# Altium schematic sheet MB_dac.SchDoc: Материнская плата
size 420 x 297 mm; DrawnBy: В.Титов; DocumentNumber: ХХХХ.468179.001 Э3; SheetNumber: 6; SheetTotal: 7; DocumentType: Схема электрическая принципиальная; Title2: Питание процессора
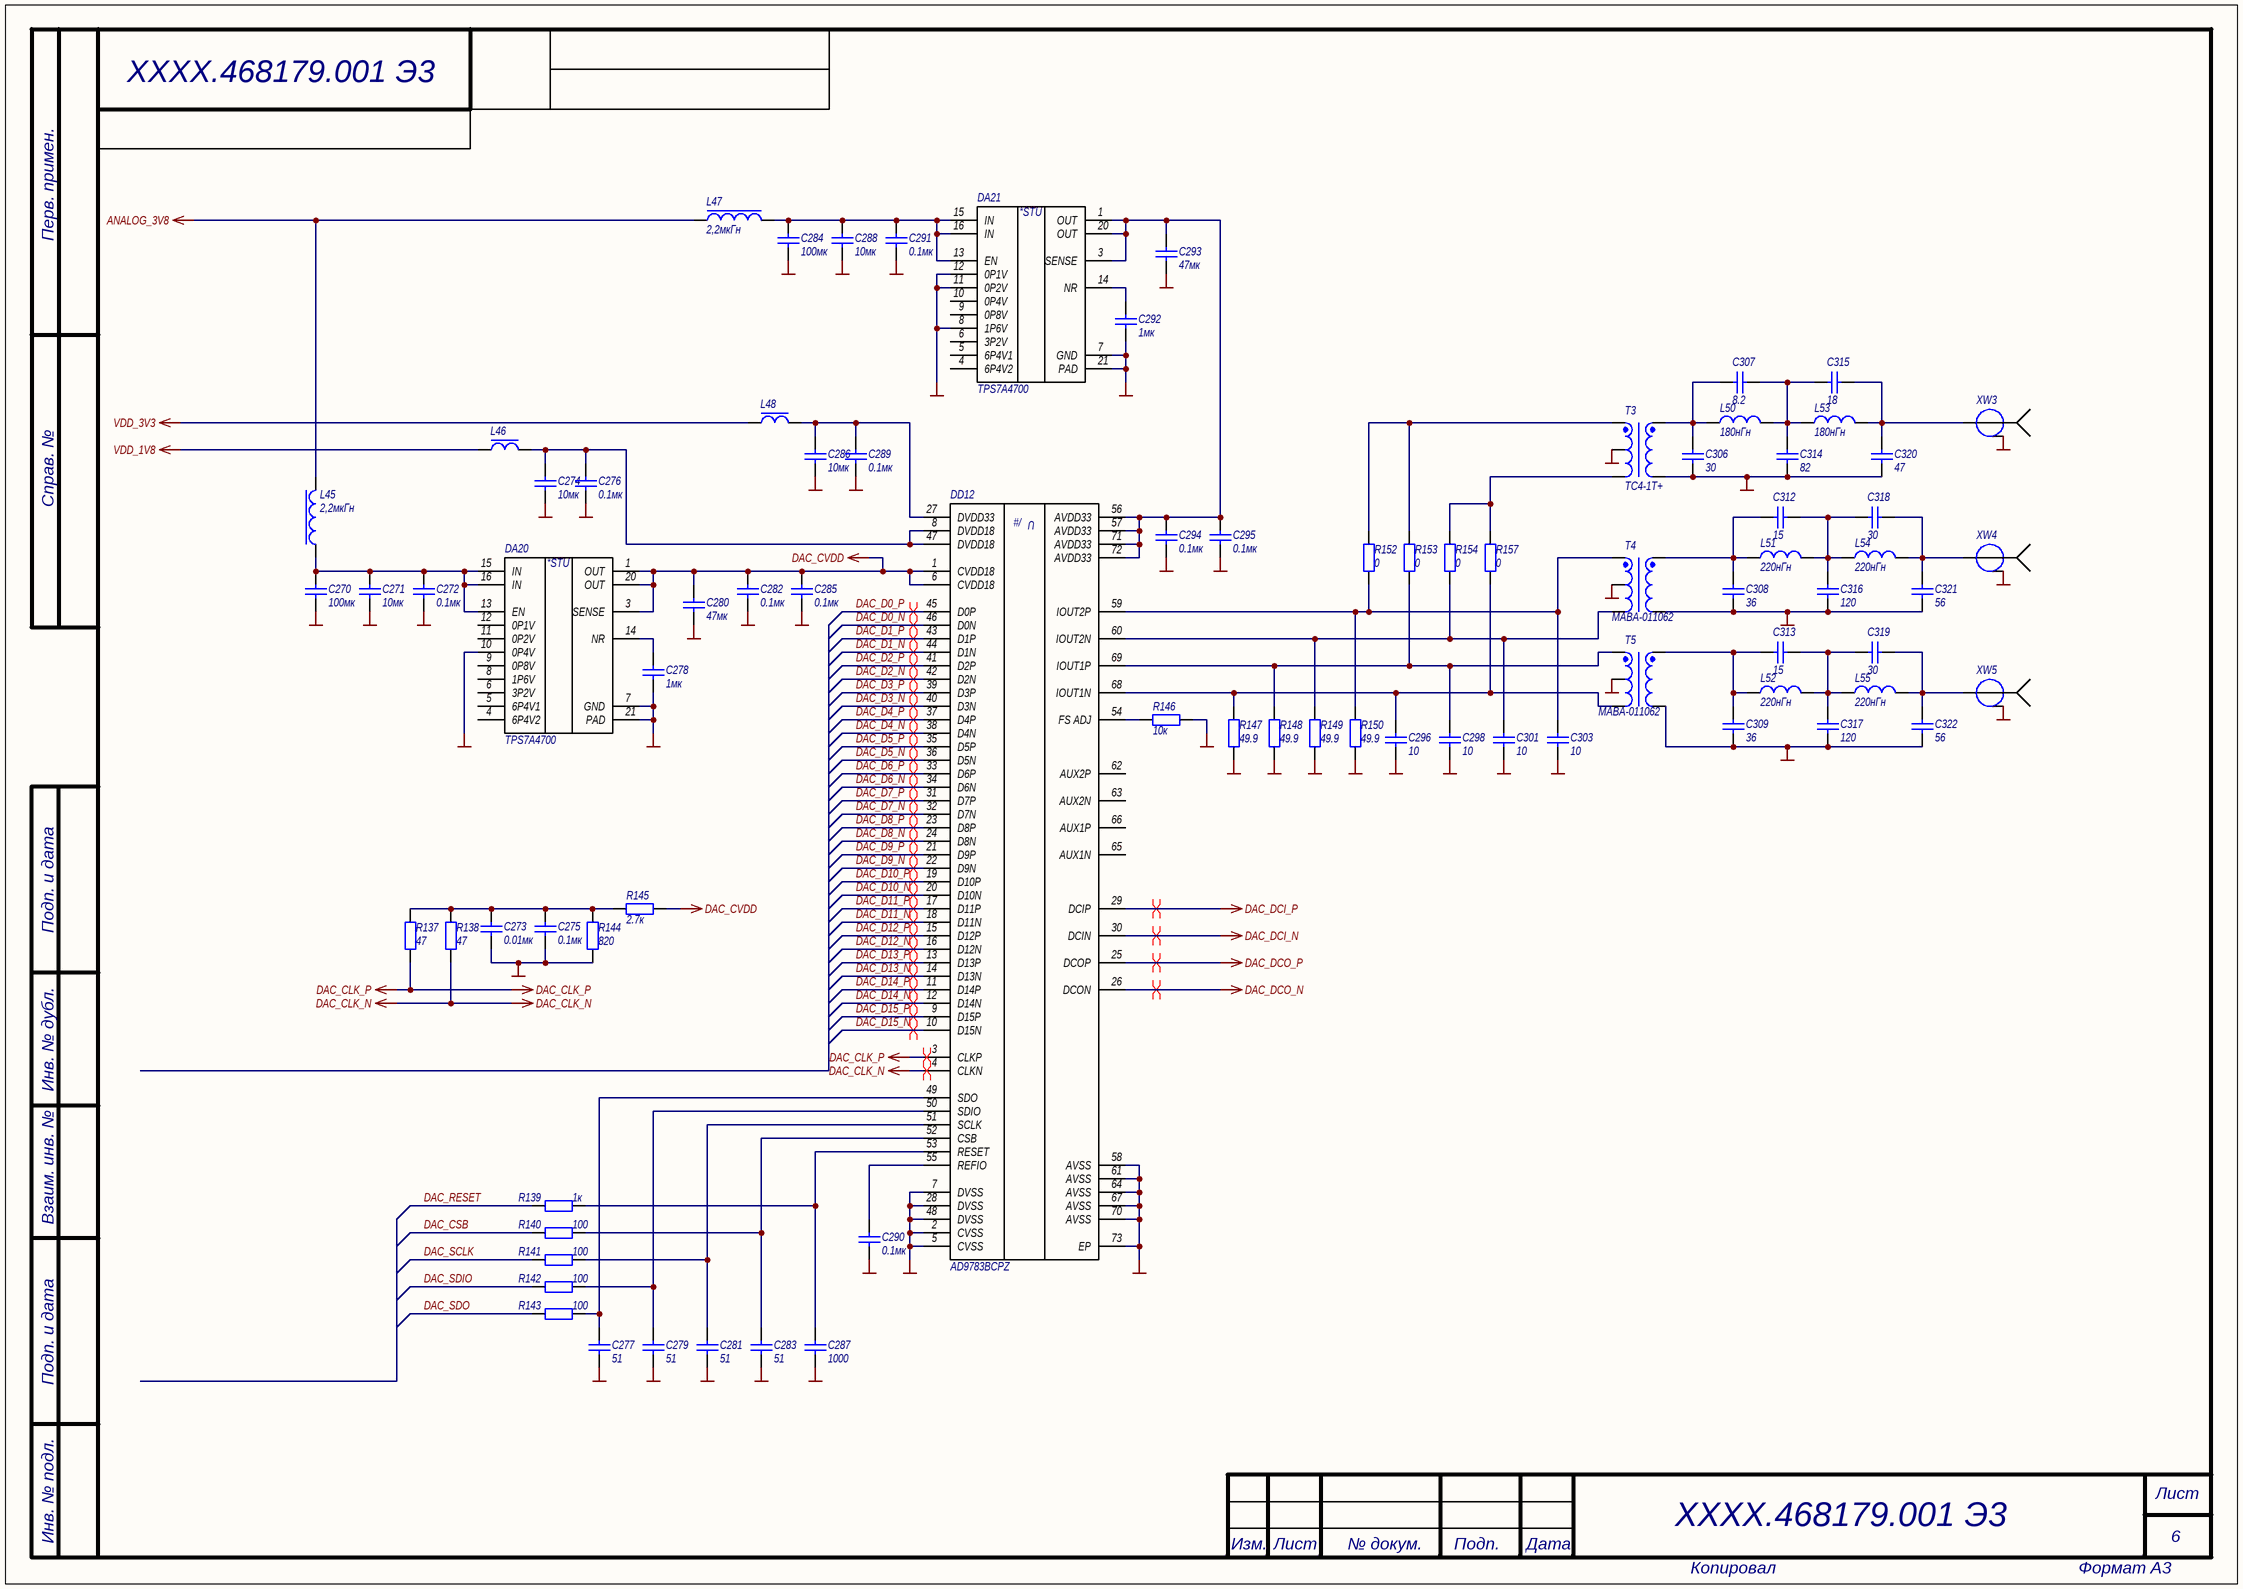
[diagram p0: MB_dac.SchDoc]

## Parts
C270  100мк  [CAPC3216X19L]
C271  10мк  [CAPC1608X08L]
C272  0.1мк  [CAPC1005X06N]
C273  0.01мк  [CAPC1005X06N]
C274  10мк  [CAPC1608X08L]
C275  0.1мк  [CAPC1005X06N]
C276  0.1мк  [CAPC1005X06N]
C277  51  [CAPC1005X06N]
C278  1мк  [CAPC1005X06N]
C279  51  [CAPC1005X06N]
C280  47мк  [CAPC2012X12L]
C281  51  [CAPC1005X06N]
C282  0.1мк  [CAPC1005X06N]
C283  51  [CAPC1005X06N]
C284  100мк  [CAPC3216X19L]
C285  0.1мк  [CAPC1005X06N]
C286  10мк  [CAPC1608X08L]
C287  1000  [CAPC1005X06N]
C288  10мк  [CAPC1608X08L]
C289  0.1мк  [CAPC1005X06N]
C290  0.1мк  [CAPC1005X06N]
C291  0.1мк  [CAPC1005X06N]
C292  1мк  [CAPC1005X06N]
C293  47мк  [CAPC2012X12L]
C294  0.1мк  [CAPC1005X06N]
C295  0.1мк  [CAPC1005X06N]
C296  10  [CAPC1005X06N]
C298  10  [CAPC1005X06N]
C301  10  [CAPC1005X06N]
C303  10  [CAPC1005X06N]
C306  30  [CAPC1005X06N]
C307  8.2  [CAPC1005X06N]
C308  36  [CAPC1005X06N]
C309  36  [CAPC1005X06N]
C312  15  [CAPC1005X06N]
C313  15  [CAPC1005X06N]
C314  82  [CAPC1005X06N]
C315  18  [CAPC1005X06N]
C316  120  [CAPC1005X06N]
C317  120  [CAPC1005X06N]
C318  30  [CAPC1005X06N]
C319  30  [CAPC1005X06N]
C320  47  [CAPC1005X06N]
C321  56  [CAPC1005X06N]
C322  56  [CAPC1005X06N]
DA20  TPS7A4700  [QFN65P500X500X100_HS-21L]
DA21  TPS7A4700  [QFN65P500X500X100_HS-21L]
DD12  AD9783BCPZ  [LFCSP_VQ_72]
L45  2,2мкГн  [CSAB0420]
L46  BLM18PG121SN1D  [INDC1608X08L]  (value not drawn)
L47  2,2мкГн  [CSAB0420]
L48  BLM18PG121SN1D  [INDC1608X08L]  (value not drawn)
L50  180нГн  [INDC0805CS]
L51  220нГн  [INDC0805CS]
L52  220нГн  [INDC0805CS]
L53  180нГн  [INDC0805CS]
L54  220нГн  [INDC0805CS]
L55  220нГн  [INDC0805CS]
R137  47  [RESC1005X06N]
R138  47  [RESC1005X06N]
R139  1к  [RESC1005X06N]
R140  100  [RESC1005X06N]
R141  100  [RESC1005X06N]
R142  100  [RESC1005X06N]
R143  100  [RESC1005X06N]
R144  820  [RESC1005X06N]
R145  2.7к  [RESC1005X06N]
R146  10к  [RESC1005X06N]
R147  49.9  [RESC1005X06N]
R148  49.9  [RESC1005X06N]
R149  49.9  [RESC1005X06N]
R150  49.9  [RESC1005X06N]
R152  0  [RESC1005X06N]
R153  0  [RESC1005X06N]
R154  0  [RESC1005X06N]
R157  0  [RESC1005X06N]
T3  TC4-1T+  [SM-22 package]
T4  MABA-011062  [SM-22 package]
T5  MABA-011062  [SM-22 package]
XW3  SMA-JR  [SMA-JR]  (value not drawn)
XW4  SMA-JR  [SMA-JR]  (value not drawn)
XW5  SMA-JR  [SMA-JR]  (value not drawn)

## Nets
ANALOG_3V8: L45.2 L47.1
DAC_CLK_N: DD12.4(CLKN) R138.2
DAC_CLK_P: DD12.3(CLKP) R137.2
DAC_CVDD: C280.2 C282.2 C285.2 DA20.1(OUT) DA20.3(SENSE) DA20.20(OUT) DD12.1(CVDD18) DD12.6(CVDD18) R145.2
DAC_DCI_N: DD12.30(DCIN)
DAC_DCI_P: DD12.29(DCIP)
DAC_DCO_N: DD12.26(DCON)
DAC_DCO_P: DD12.25(DCOP)
GND: C270.1 C271.1 C272.1 C273.1 C274.1 C275.1 C276.1 C277.1 C278.1 C279.1 C280.1 C281.1 C282.1 C283.1 C284.1 C285.1 C286.1 C287.1 C288.1 C289.1 C290.1 C291.1 C292.1 C293.1 C294.1 C295.1 C296.1 C298.1 C301.1 C303.1 C306.1 C308.1 C309.1 C314.1 C316.1 C317.1 C320.1 C321.1 C322.1 DA20.7(GND) DA20.10(0P4V) DA20.21(PAD) DA21.7(GND) DA21.8(1P6V) DA21.11(0P2V) DA21.12(0P1V) DA21.21(PAD) DD12.2(CVSS) DD12.5(CVSS) DD12.7(DVSS) DD12.28(DVSS) DD12.48(DVSS) DD12.58(AVSS) DD12.61(AVSS) DD12.64(AVSS) DD12.67(AVSS) DD12.70(AVSS) DD12.73(EP) R144.2 R146.2 R147.2 R148.2 R149.2 R150.2 T3.2(SECONARY_CT) T3.4(PRIMARY) T4.2(SECONARY_CT) T4.4(PRIMARY) T5.2(SECONARY_CT) T5.4(PRIMARY) XW3.2 XW4.2 XW5.2
VDD_1V8: L46.1
VDD_3V3: L48.1
DAC_CSB: R140.1
DAC_D0_N: DD12.46(D0N)
DAC_D0_P: DD12.45(D0P)
DAC_D1_N: DD12.44(D1N)
DAC_D1_P: DD12.43(D1P)
DAC_D2_N: DD12.42(D2N)
DAC_D2_P: DD12.41(D2P)
DAC_D3_N: DD12.40(D3N)
DAC_D3_P: DD12.39(D3P)
DAC_D4_N: DD12.38(D4N)
DAC_D4_P: DD12.37(D4P)
DAC_D5_N: DD12.36(D5N)
DAC_D5_P: DD12.35(D5P)
DAC_D6_N: DD12.34(D6N)
DAC_D6_P: DD12.33(D6P)
DAC_D7_N: DD12.32(D7N)
DAC_D7_P: DD12.31(D7P)
DAC_D8_N: DD12.24(D8N)
DAC_D8_P: DD12.23(D8P)
DAC_D9_N: DD12.22(D9N)
DAC_D9_P: DD12.21(D9P)
DAC_D10_N: DD12.20(D10N)
DAC_D10_P: DD12.19(D10P)
DAC_D11_N: DD12.18(D11N)
DAC_D11_P: DD12.17(D11P)
DAC_D12_N: DD12.16(D12N)
DAC_D12_P: DD12.15(D12P)
DAC_D13_N: DD12.14(D13N)
DAC_D13_P: DD12.13(D13P)
DAC_D14_N: DD12.12(D14N)
DAC_D14_P: DD12.11(D14P)
DAC_D15_N: DD12.10(D15N)
DAC_D15_P: DD12.9(D15P)
DAC_RESET: R139.1
DAC_SCLK: R141.1
DAC_SDIO: R142.1
DAC_SDO: R143.1
NetC270_2: C270.2 C271.2 C272.2 DA20.13(EN) DA20.15(IN) DA20.16(IN) L45.1
NetC273_2: C273.2 C275.2 R137.1 R138.1 R144.1 R145.1
NetC274_2: C274.2 C276.2 DD12.8(DVDD18) DD12.47(DVDD18) L46.2
NetC277_2: C277.2 DD12.49(SDO) R143.2
NetC278_2: C278.2 DA20.14(NR)
NetC279_2: C279.2 DD12.50(SDIO) R142.2
NetC281_2: C281.2 DD12.51(SCLK) R141.2
NetC283_2: C283.2 DD12.52(CSB) R140.2
NetC284_2: C284.2 C288.2 C291.2 DA21.13(EN) DA21.15(IN) DA21.16(IN) L47.2
NetC286_2: C286.2 C289.2 DD12.27(DVDD33) L48.2
NetC287_2: C287.2 DD12.53(RESET) R139.2
NetC290_2: C290.2 DD12.55(REFIO)
NetC292_2: C292.2 DA21.14(NR)
NetC293_2: C293.2 C294.2 C295.2 DA21.1(OUT) DA21.3(SENSE) DA21.20(OUT) DD12.56(AVDD33) DD12.57(AVDD33) DD12.71(AVDD33) DD12.72(AVDD33)
NetC296_2: C296.2 DD12.68(IOUT1N) R147.1 R157.2 T5.3(SECONDARY)
NetC298_2: C298.2 DD12.69(IOUT1P) R148.1 R153.2 T5.1(SECONDARY_DOT)
NetC301_2: C301.2 DD12.60(IOUT2N) R149.1 R154.2 T4.3(SECONDARY)
NetC303_2: C303.2 DD12.59(IOUT2P) R150.1 R152.2 T4.1(SECONDARY_DOT)
NetC306_2: C306.2 C307.2 L50.1 T3.5(PRIMARY_DOT)
NetC307_1: C307.1 C314.2 C315.2 L50.2 L53.1
NetC308_2: C308.2 C312.2 L51.1 T4.5(PRIMARY_DOT)
NetC309_2: C309.2 C313.2 L52.1 T5.5(PRIMARY_DOT)
NetC312_1: C312.1 C316.2 C318.2 L51.2 L54.1
NetC313_1: C313.1 C317.2 C319.2 L52.2 L55.1
NetC315_1: C315.1 C320.2 L53.2 XW3.1
NetC318_1: C318.1 C321.2 L54.2 XW4.1
NetC319_1: C319.1 C322.2 L55.2 XW5.1
NetDD12_54: DD12.54(FS_ADJ) R146.1
NetR152_1: R152.1 R153.1 T3.1(SECONDARY_DOT)
NetR154_1: R154.1 R157.1 T3.3(SECONDARY)

Not connected (* = marked no-connect by the designer): DA20 4(6P4V2) 5(6P4V1) 6(3P2V) 8(1P6V) 9(0P8V) 11(0P2V) 12(0P1V); DA21 4(6P4V2) 5(6P4V1) 6(3P2V) 9(0P8V) 10(0P4V); DD12 62(AUX2P) 63(AUX2N) 65(AUX1N) 66(AUX1P)

## Layout directives
differential pair: DAC_CLK_N, DAC_CLK_P, DAC_D0_N, DAC_D0_P, DAC_D1_N, DAC_D1_P, DAC_D2_N, DAC_D2_P, DAC_D3_N, DAC_D3_P, DAC_D4_N, DAC_D4_P, DAC_D5_N, DAC_D5_P, DAC_D6_N, DAC_D6_P, DAC_D7_N, DAC_D7_P, DAC_D8_N, DAC_D8_P, DAC_D9_N, DAC_D9_P, DAC_D10_N, DAC_D10_P, DAC_D11_N, DAC_D11_P, DAC_D12_N, DAC_D12_P, DAC_D13_N, DAC_D13_P, DAC_D14_N, DAC_D14_P, DAC_D15_N, DAC_D15_P, DAC_DCI_N, DAC_DCI_P, DAC_DCO_N, DAC_DCO_P

## Notes on the sheet
- Перв. примен.
- Справ. №
- Подп. и дата
- Инв. № дубл.
- Взаим. инв. №
- Инв. № подл.
- Лист
- Изм.
- № докум.
- Подп.
- Дата
- Копировал
- Формат А3
- (in symbol Микросхема AD9783BCPZ) U; #/
- (in symbol Микросхема TPS7A4700RGW) *STU

## Library data of the parts
C270 C284 = Кер.ЧИП конд. 1206 100мкФ X5R 20% 6.3В: Кер. ЧИП-конденсатор; Manufacturer: Murata; ManufacturerPartNumber: GRM31CR60J107ME39L; Power/Voltage: 6.3В; TKE: X5R; Tolerance: ±20%; Value: 100мк
C271 C274 C286 C288 = Кер.ЧИП конд. 0603 10мкФ X5R 20% 6.3В: Кер. ЧИП-конденсатор; Manufacturer: Murata; ManufacturerPartNumber: GRM188R61A106KE69D; Power/Voltage: 6.3В; TKE: X5R; Tolerance: ±20%; Value: 10мк
C272 C275 C276 C282 C285 C289-C291 C294 C295 = Кер.ЧИП конд. 0402 0.1мкФ X7R 10%, 16В: Кер. ЧИП-конденсатор; Power/Voltage: 16В; TKE: X7R; Tolerance: ±10%; PackageReference: 0402; Value: 0.1мк
C273 = Кер.ЧИП конд. 0402 0.01мкФ X7R 10%, 50В: Кер. ЧИП-конденсатор; Power/Voltage: 50В; TKE: X7R; Tolerance: ±20%; Value: 0.01мк
C277 C279 C281 C283 = Кер.ЧИП конд. 0402 51пФ NPO 5%, 50В: Кер. ЧИП-конденсатор; Power/Voltage: 50В; TKE: NPO; Tolerance: ±5%; PackageReference: 0402; Value: 51
C278 C292 = Кер.ЧИП конд. 0402 1мкФ X5R 10%, 10В: Кер. ЧИП-конденсатор; Power/Voltage: 10В; TKE: X5R; Tolerance: ±10%; PackageReference: 0402; Value: 1мк
C280 C293 = Кер.ЧИП конд. 0805 47мкФ X5R 20% 10В: Кер. ЧИП-конденсатор; Manufacturer: Murata; ManufacturerPartNumber: GRM21BR61A476ME15L; Power/Voltage: 10В; TKE: X5R; Tolerance: ±20%; Value: 47мк
C287 = Кер.ЧИП конд. 0402 1000пФ NP0 5%, 50В: Кер. ЧИП-конденсатор; Power/Voltage: 50В; TKE: NPO; Tolerance: ±5%; PackageReference: 0402; Value: 1000
C296 C298 C301 C303 = Кер.ЧИП конд. 0402 10пФ NPO 5%, 50В: Кер. ЧИП-конденсатор; Power/Voltage: 50В; TKE: NPO; Tolerance: ±5%; PackageReference: 0402; Value: 10
C306 C318 C319 = Кер.ЧИП конд. 0402 30пФ NPO 5%, 50В: Кер. ЧИП-конденсатор; Power/Voltage: 50В; TKE: NPO; Tolerance: ±5%; PackageReference: 0402; Value: 30
C307 = Кер.ЧИП конд. 0402 8.2пФ C0G, 50В: Кер. ЧИП-конденсатор; Power/Voltage: 50В; TKE: C0G; Tolerance: ±5%; Value: 8.2
C308 C309 = Кер.ЧИП конд. 0402 36пФ NPO 5%, 50В: Кер. ЧИП-конденсатор; Power/Voltage: 50В; TKE: NPO; Tolerance: ±5%; PackageReference: 0402; Value: 36
C312 C313 = Кер.ЧИП конд. 0402 15пФ NPO 5%, 50В: Кер. ЧИП-конденсатор; Power/Voltage: 50В; TKE: NPO; Tolerance: ±5%; PackageReference: 0402; Value: 15
C314 = Кер.ЧИП конд. 0402 82пФ NPO 5%, 50В: Кер. ЧИП-конденсатор; Power/Voltage: 50В; TKE: NPO; Tolerance: ±5%; PackageReference: 0402; Value: 82
C315 = Кер.ЧИП конд. 0402 18пФ NPO 5%, 50В: Кер. ЧИП-конденсатор; Power/Voltage: 50В; TKE: NPO; Tolerance: ±5%; PackageReference: 0402; Value: 18
C316 C317 = Кер.ЧИП конд. 0402 120пФ NPO 5%, 50В: Кер. ЧИП-конденсатор; Power/Voltage: 50В; TKE: NPO; Tolerance: ±5%; PackageReference: 0402; Value: 120
C320 = Кер.ЧИП конд. 0402 47пФ NPO 5%, 50В: Кер. ЧИП-конденсатор; Power/Voltage: 50В; TKE: NPO; Tolerance: ±5%; PackageReference: 0402; Value: 47
C321 C322 = Кер.ЧИП конд. 0402 56пФ NPO 5%, 50В: Кер. ЧИП-конденсатор; Power/Voltage: 50В; TKE: NPO; Tolerance: ±5%; PackageReference: 0402; Value: 56
DA20 DA21 = Микросхема TPS7A4700RGW: 36-V, 1-A, 4-µVRMS, RF LDO Voltage Regulator; Manufacturer: TI; Value: TPS7A4700; ComponentLink1Description: datasheet; ComponentLink1URL: http://www.ti.com/lit/ds/symlink/tps7a47.pdf
DD12 = Микросхема AD9783BCPZ: Dual 12-/14-/16-Bit, LVDS Interface, 500 MSPS DACs; Manufacturer: AD; Value: AD9783BCPZ; ComponentLink1Description: datasheet; ComponentLink1URL: http://www.analog.com/media/en/technical-documentation/data-sheets/AD9780_9781_9783.pdf
L45 L47 = ЧИП индуктивность CSAB0420-2R2M: Molding Power Choke; Manufacturer: Vishay; ManufacturerPartNumber: IHLP1616ABER1R0M11; Value: 2,2мкГн
L46 L48 = ЧИП дроссель 0603 BLM18PG121SN1D: SMD EMI Suppression Filter EMIFIL; Manufacturer: Murata; ManufacturerPartNumber: BLM18PG121SN1D; Value: BLM18PG121SN1D
L50 L53 = ЧИП индуктивность 0805CS-181XGL: Value: 180нГн
L51 L52 L54 L55 = ЧИП индуктивность 0805CS-221XGL: Value: 220нГн
R137 R138 = Чип резистор 0402 47 Ом, 5%: ЧИП-резистор; Tolerance: ±5%; TKE: 100 ppm/°С; PackageReference: 0402; Value: 47
R139 = Чип резистор 0402 1 кОм, 5%: ЧИП-резистор; Tolerance: ±5%; TKE: 100 ppm/°С; PackageReference: 0402; Value: 1к
R140-R143 = Чип резистор 0402 100 Ом, 5%: ЧИП-резистор; Tolerance: ±5%; TKE: 100 ppm/°С; PackageReference: 0402; Value: 100
R144 = Чип резистор 0402 820 Ом, 5%: ЧИП-резистор; Tolerance: ±5%; TKE: 100 ppm/°С; PackageReference: 0402; Value: 820
R145 = Чип резистор 0402 2.7 кОм, 5%: ЧИП-резистор; Tolerance: ±5%; TKE: 100 ppm/°С; Published: 8-Jun-2000; LatestRevisionDate: 17-Jul-2002; LatestRevisionNote: Re-released for DXP Platform.; Publisher: Altium Limited; PackageReference: 0402; Value: 2.7к
R146 = Чип резистор 0402 10 кОм, 5%: ЧИП-резистор; Tolerance: ±5%; TKE: 100 ppm/°С; PackageReference: 0402; Value: 10к
R147-R150 = Чип резистор 0402 49,9 Ом, 1%: ЧИП-резистор; Tolerance: ±1%; TKE: 100 ppm/°С; PackageReference: 0402; Value: 49.9
R152-R154 R157 = Чип резистор 0402 0 Ом: ЧИП-резистор; Tolerance: ±5%; TKE: 100 ppm/°С; PackageReference: 0402; Value: 0
T3 = ЧИП трансформатор TC4-1T+: RF Transformer 50Ω 0.5 to 300 MHz 1:4; Manufacturer: minicircuits; ManufacturerPartNumber: ADT2-1T+; Value: TC4-1T+; ComponentLink1Description: datasheet; ComponentLink1URL: https://ww2.minicircuits.com/pdfs/ADT2-1T+.pdf
T4 T5 = ЧИП трансформатор MABA-011062: 1:2 Step up Flux Coupled Balun Transformer 1 – 300 MHz; Manufacturer: MACOM; Value: MABA-011062; ComponentLink1Description: datasheet; ComponentLink1URL: https://cdn.macom.com/datasheets/MABA-011062.pdf; ManufacturerPartNumber: MABA-011062
XW3-XW5 = Соединитель коаксиальный SMA-JR: SMA-JR Разъем SMA гнездо на плату, прямой угол; Value: SMA-JR; ComponentLink1Description: datasheet; ComponentLink1URL: http://www.brownbear.ru/goods/2243.html